# Altium schematic sheet Meter_Junction.SchDoc
size Tabloid
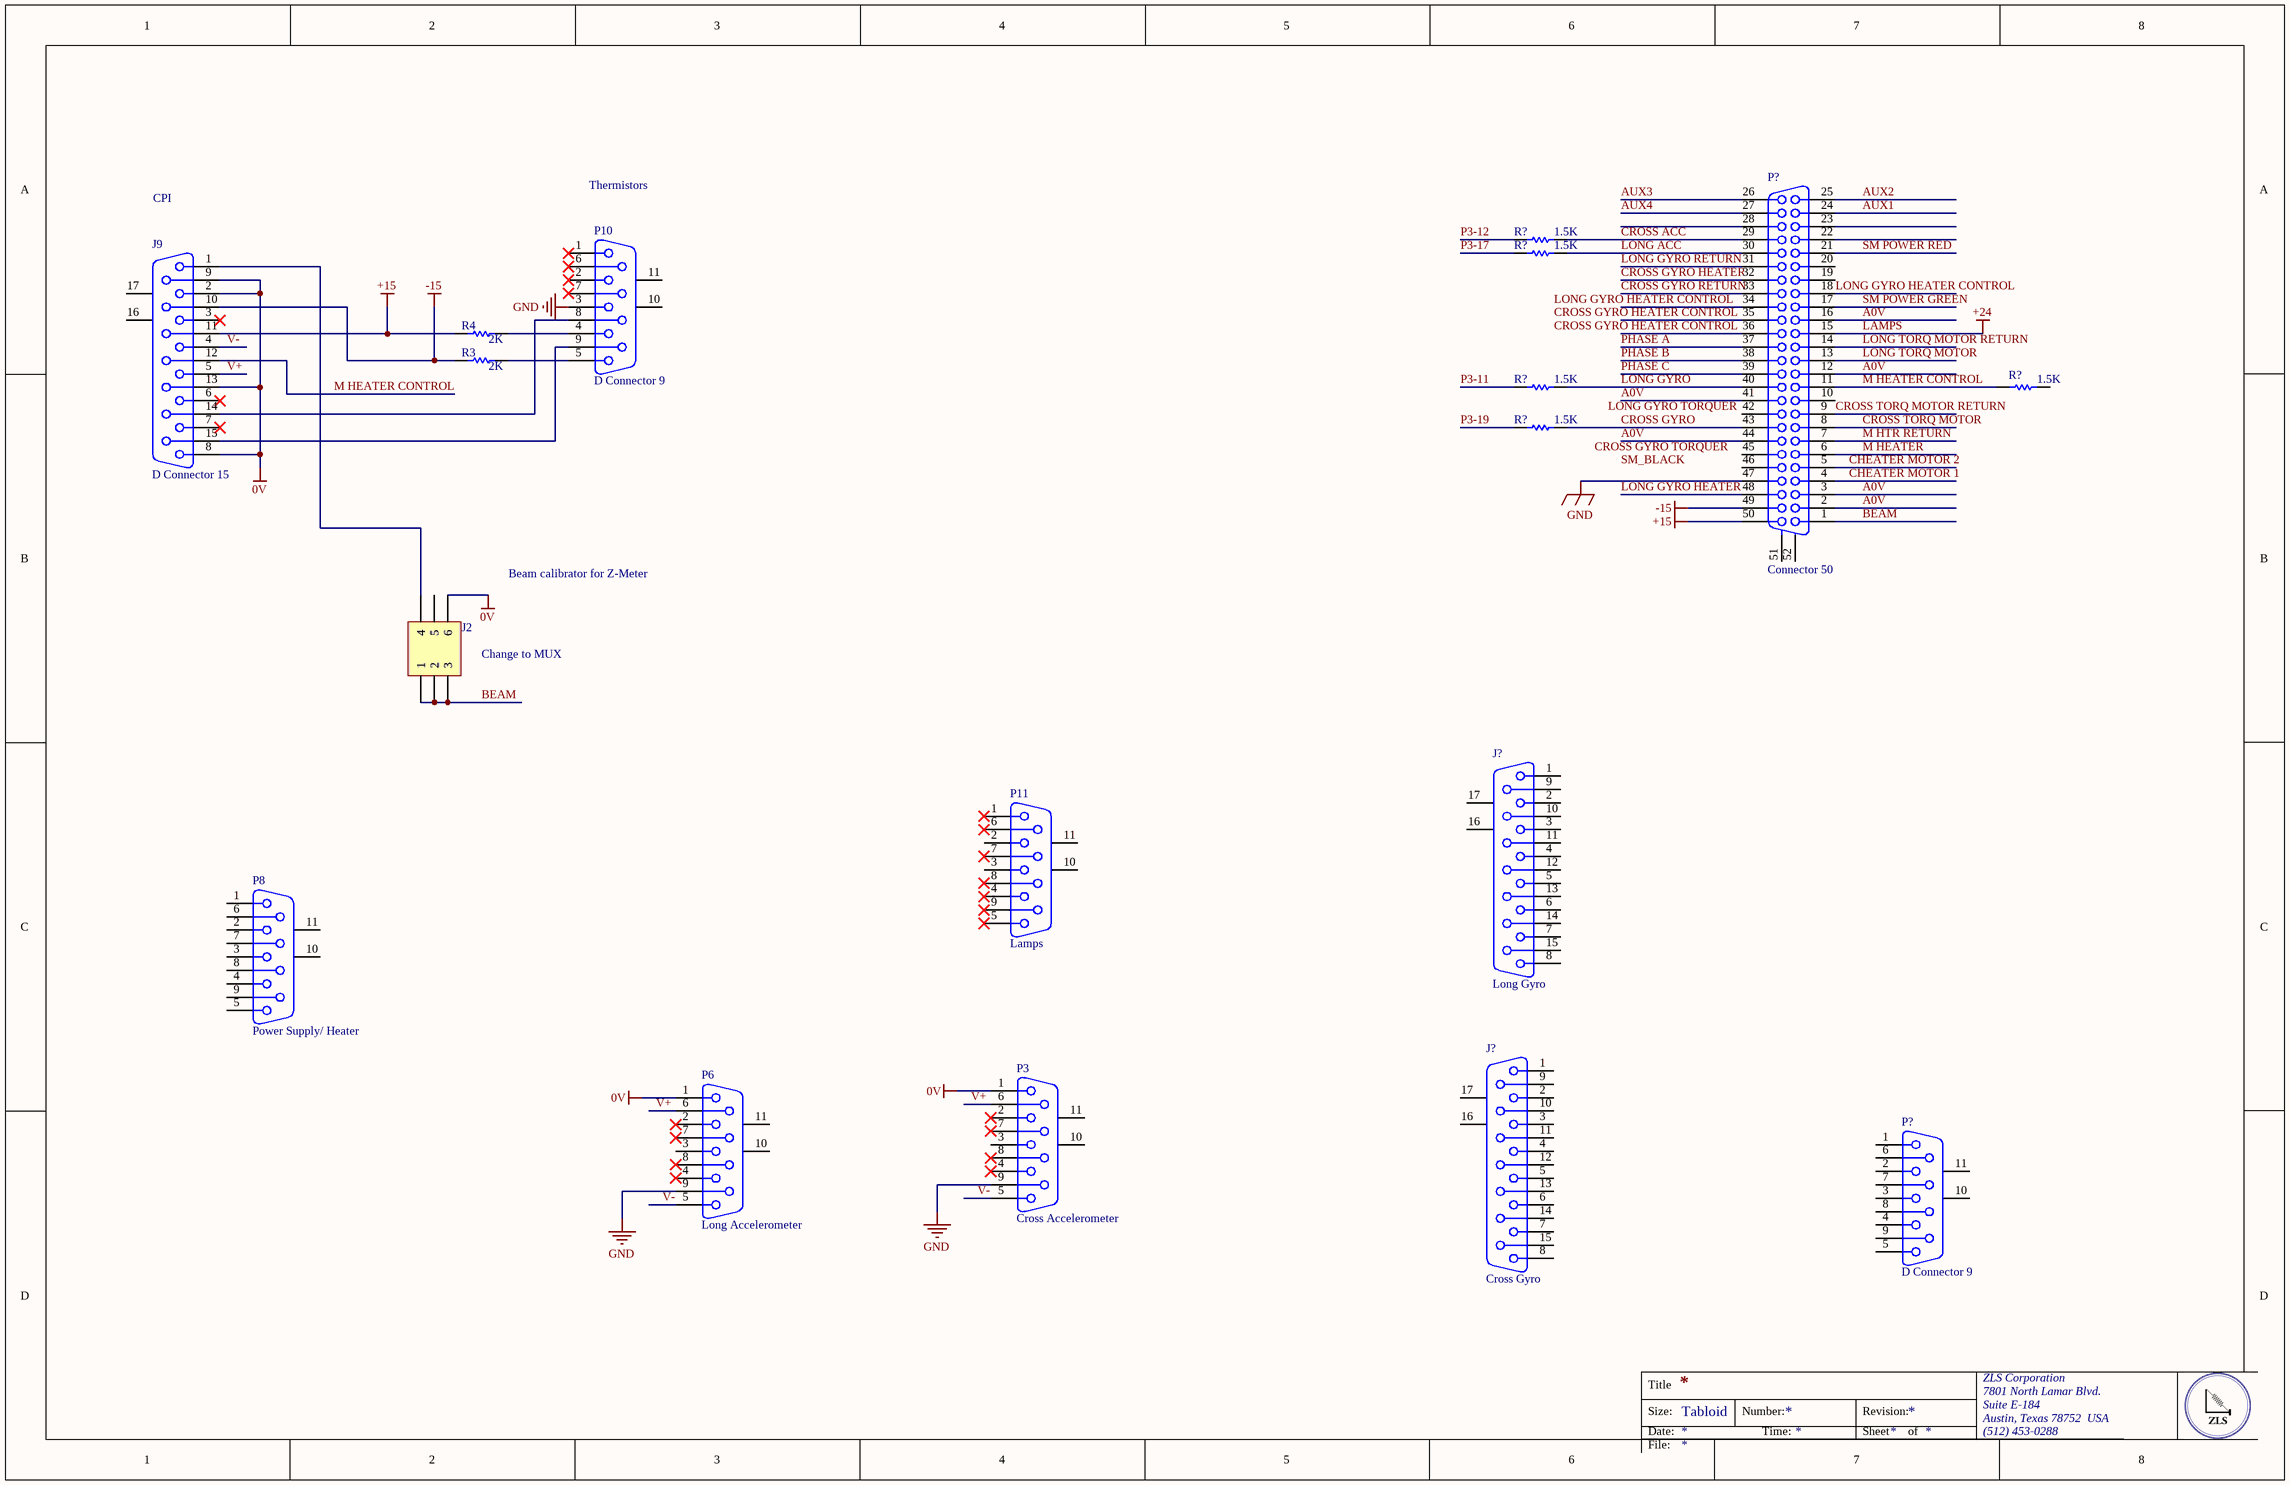
[diagram p0: Meter_Junction.SchDoc]

## Parts
(Parts that share a designator on the sheet are numbered #1, #2 ... from top to bottom, then left to right.)
J2  Header 3X2A  [HDR2X3_CEN]  (value not drawn)
J9  D Connector 15  [DSUB1.385-2H15]
J?#1  Long Gyro  [DSUB1.385-2H15]
J?#2  Cross Gyro  [DSUB1.385-2H15]
P3  Cross Accelerometer  [DSUB1.385-2H9]
P6  Long Accelerometer  [DSUB1.385-2H9]
P8  Power Supply/ Heater  [DSUB1.385-2H9]
P10  D Connector 9  [DSUB1.385-2H9]
P11  Lamps  [DSUB1.385-2H9]
P?#1  Connector 50  [CHAMP1.27-2H50]
P?#2  D Connector 9  [DSUB1.385-2H9]
R3  2K  [AXIAL-0.3]
R4  2K  [AXIAL-0.3]
R?#1  value 1.5K  [AXIAL-0.3]  (hidden comment: Res1)
R?#2  value 1.5K  [AXIAL-0.3]  (hidden comment: Res1)
R?#3  value 1.5K  [AXIAL-0.3]  (hidden comment: Res1)
R?#4  value 1.5K  [AXIAL-0.3]  (hidden comment: Res1)
R?#5  value 1.5K  [AXIAL-0.3]  (hidden comment: Res1)

## Nets
0V: J2.6 J9.2 J9.8 J9.9 J9.13 P3.1 P6.1
+15: J9.11 P?#1.50 R4.1
-15: J9.10 P?#1.49 R3.1
GND: P3.9 P6.9 P10.3 P?#1.47
LAMPS: P?#1.15  [also labelled +24]
A0V: P?#1.2 P?#1.3 P?#1.12 P?#1.16 P?#1.41 P?#1.44
AUX1: P?#1.24
AUX2: P?#1.25
AUX3: P?#1.26
AUX4: P?#1.27
BEAM: J2.1 J2.2 J2.3 P?#1.1
CHEATER MOTOR 1: P?#1.4
CHEATER MOTOR 2: P?#1.5
CROSS ACC: P?#1.29 R?#1.2
CROSS GYRO: P?#1.43 R?#5.2
CROSS GYRO HEATER: P?#1.32
CROSS GYRO RETURN: P?#1.33
CROSS TORQ MOTOR: P?#1.8
CROSS TORQ MOTOR RETURN: P?#1.9
LONG ACC: P?#1.30 R?#2.2
LONG GYRO: P?#1.40 R?#3.2
LONG GYRO HEATER: P?#1.48
LONG GYRO HEATER CONTROL: P?#1.18
LONG GYRO RETURN: P?#1.31
LONG TORQ MOTOR: P?#1.13
LONG TORQ MOTOR RETURN: P?#1.14
M HEATER: P?#1.6
M HEATER CONTROL: J9.12 P?#1.11 R?#4.1
M HTR RETURN: P?#1.7
P3-11: R?#3.1
P3-12: R?#1.1
P3-17: R?#2.1
P3-19: R?#5.1
PHASE A: P?#1.37
PHASE B: P?#1.38
PHASE C: P?#1.39
SM POWER GREEN: P?#1.17
SM POWER RED: P?#1.21
V+: J9.5 P3.6 P6.6
V-: J9.4 P3.5 P6.5
NetJ2_4: J2.4 J9.1
NetJ9_14: J9.14 P10.8
NetJ9_15: J9.15 P10.9
NetP10_4: P10.4 R4.2
NetP10_5: P10.5 R3.2

Not connected (* = marked no-connect by the designer): J2 5; J9 3* 6* 7* 16(MH1) 17(MH2); J?#1 1 2 3 4 5 6 7 8 9 10 11 12 13 14 15 16(MH1) 17(MH2); J?#2 1 2 3 4 5 6 7 8 9 10 11 12 13 14 15 16(MH1) 17(MH2); P3 2* 3 4* 7* 8* 10(MH1) 11(MH2); P6 2* 3 4* 7* 8* 10(MH1) 11(MH2); P8 1 2 3 4 5 6 7 8 9 10(MH1) 11(MH2); P10 1* 2* 6* 7* 10(MH1) 11(MH2); P11 1* 2 3 4* 5* 6* 7* 8* 9* 10(MH1) 11(MH2); P?#1 10 19 20 22 23 28 34 35 36 42 45 46 51(MH1) 52(MH2); P?#2 1 2 3 4 5 6 7 8 9 10(MH1) 11(MH2); R?#4 2

## Notes on the sheet
- CPI
- Thermistors
- Beam calibrator for Z-Meter
- (near J2) Change to MUX
- Labels drawn without touching a wire or pin: CROSS GYRO HEATER CONTROL, CROSS GYRO TORQUER, LONG GYRO HEATER CONTROL, LONG GYRO TORQUER, SM_BLACK
- Title
- Size:
- Date:
- Tabloid
- Number:
- Time:
- Revision:
- Sheet
- of
- ZLS Corporation
- 7801 North Lamar Blvd.
- Suite E-184
- Austin, Texas 78752  USA
- (512) 453-0288
- File:

## Library data of the parts
J2 = Header 3X2A: Header, 3-Pin, Dual row; LatestRevisionDate: 17-Jul-2002; LatestRevisionNote: Re-released for DXP Platform.; Publisher: Altium Limited
J9 J?#1 J?#2 = D Connector 15: Receptacle Assembly, 15 Position, Right Angle; PackageDocument: O; Positions: 15; Published: 15-Jun-2001; LatestRevisionDate: 17-Jul-2002; LatestRevisionNote: Re-released for DXP Platform.; DatasheetDocument: 1-Sep-99; PackageReference: 788757; Publisher: Altium Limited; Orientation: Right Angle; Gender: Receptacle
P3 P6 P8 P10 P11 P?#2 = D Connector 9: Receptacle Assembly, 9 Position, Right Angle; PackageDocument: O; Positions: 9; Published: 15-Jun-2001; LatestRevisionDate: 17-Jul-2002; LatestRevisionNote: Re-released for DXP Platform.; DatasheetDocument: 1-Sep-1999; PackageReference: 788750; Publisher: Altium Limited; Orientation: Right Angle; Gender: Receptacle
P?#1 = Connector 50: Receptacle Header Assemby; PackageDocument: B; Positions: 50; Published: 15-Jun-2001; LatestRevisionDate: 17-Jul-2002; LatestRevisionNote: Re-released for DXP Platform.; DatasheetDocument: 1-Oct-1983; PackageReference: 178240-7; Publisher: Altium Limited; Orientation: Right Angle
R3 R4 R?#1-R?#5 = Res1: Resistor
  R?#1-R?#5: Published: 8-Jun-2000; LatestRevisionDate: 17-Jul-2002; LatestRevisionNote: Re-released for DXP Platform.; PackageReference: AXIAL-0.3; Publisher: Altium Limited; PackageDescription: Axial Device, Thru-Hole; 2 Leads; 0.3 in Pin Spacing